# Altium project PCB_Project1.PrjPCB
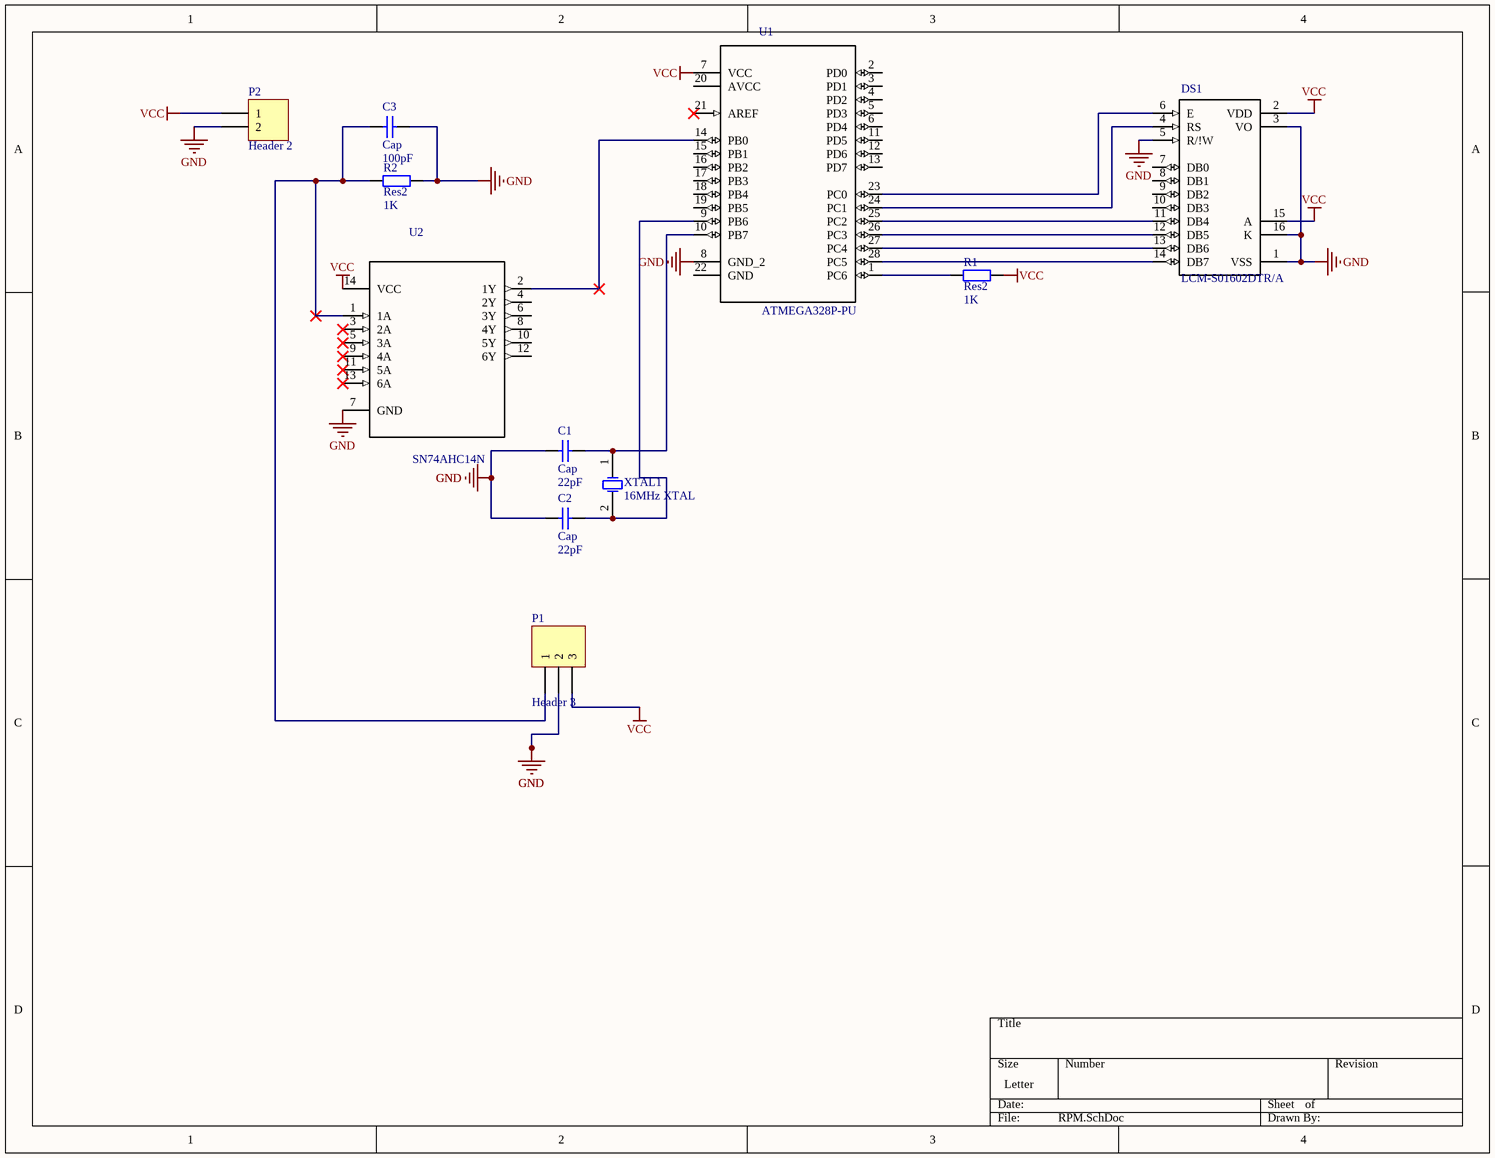
[diagram p0: RPM.SchDoc]
1 sheet, 11 parts. Net scope: global (net labels, ports and power ports of the same name join across sheets).
Board file: PCB1.PcbDoc

## Sheet RPM.SchDoc
size Letter

### Parts
C1  Cap  value 22pF  [RAD-0.3]
C2  Cap  value 22pF  [RAD-0.3]
C3  Cap  value 100pF  [RAD-0.3]
DS1  LCM-S01602DTR/A  [LCD_LCM-S01602DTR/A]
P1  Header 3  [HDR1X3]
P2  Header 2  [HDR1X2]
R1  Res2  value 1K  [AXIAL-0.4]
R2  Res2  value 1K  [AXIAL-0.4]
U1  ATMEGA328P-PU  [DIP254P762X457-28]  (net tie, no BOM)
U2  SN74AHC14N  [DIP254P762X508-14]
XTAL1  16MHz XTAL  [R38]

### Nets
GND: C1.1 C2.1 C3.2 DS1.1(VSS) DS1.3(VO) DS1.5(R/!W) DS1.16(K) P1.2 P2.2 R2.2 U1.8(GND_2) U2.7(GND)
VCC: DS1.2(VDD) DS1.15(A) P1.3 P2.1 R1.2 U1.7(VCC) U2.14(VCC)
NetC1_2: C1.2 U1.10(PB7) XTAL1.1(OSC1)
NetC2_2: C2.2 U1.9(PB6) XTAL1.2(OSC2)
NetC3_1: C3.1 P1.1 R2.1 U2.1(1A)
NetDS1_4: DS1.4(RS) U1.24(PC1)
NetDS1_6: DS1.6(E) U1.23(PC0)
NetDS1_11: DS1.11(DB4) U1.25(PC2)
NetDS1_12: DS1.12(DB5) U1.26(PC3)
NetDS1_13: DS1.13(DB6) U1.27(PC4)
NetDS1_14: DS1.14(DB7) U1.28(PC5)
NetR1_1: R1.1 U1.1(PC6)
NetU1_14: U1.14(PB0) U2.2(1Y)

Not connected (* = marked no-connect by the designer): DS1 7(DB0) 8(DB1) 9(DB2) 10(DB3); U1 2(PD0) 3(PD1) 4(PD2) 5(PD3) 6(PD4) 11(PD5) 12(PD6) 13(PD7) 15(PB1) 16(PB2) 17(PB3) 18(PB4) 19(PB5) 20(AVCC) 21(AREF)* 22(GND); U2 3(2A)* 4(2Y) 5(3A)* 6(3Y) 8(4Y) 9(4A)* 10(5Y) 11(5A)* 12(6Y) 13(6A)*

### Library data of the parts
C1-C3 = Cap: Capacitor; Published: 8-Jun-2000; LatestRevisionDate: 17-Jul-2002; LatestRevisionNote: Re-released for DXP Platform.; PackageReference: RAD-0.3; Publisher: Altium Limited; PackageDescription: Radial Cap, Thru-Hole; 2 Leads; 0.3 in Pin Spacing
DS1 = LCM-S01602DTR/A: Module, LCD; 16 x 2 mm; 5 x 8; 5 V _Typ._; 2 mA _Typ._; 4.2 V @50 degC _Min._; MF: Lumex; SnapEDA_Link: https://www.snapeda.com/parts/LCM-S01602DTR/A/Lumex%2520Opto/Components%2520Inc/view-part/?ref=snap; Availability: Warning; MP: LCM-S01602DTR/A; Price: 8.26 USD; Package: None; Value: *
P1 = Header 3: Header, 3-Pin; LatestRevisionDate: 17-Jul-2002; LatestRevisionNote: Re-released for DXP Platform.; Publisher: Altium Limited
P2 = Header 2: Header, 2-Pin; LatestRevisionDate: 17-Jul-2002; LatestRevisionNote: Re-released for DXP Platform.; Publisher: Altium Limited
R1 R2 = Res2: Resistor; Published: 8-Jun-2000; LatestRevisionDate: 17-Jul-2002; LatestRevisionNote: Re-released for DXP Platform.; PackageReference: AXIAL-0.4; Publisher: Altium Limited; PackageDescription: Axial Device, Thru-Hole; 2 Leads; 0.4 in Pin Spacing
U1 = ATMEGA328P-PU: Embedded microcontroller ATMEGA328P-PU PDIP 28 Microchip Technology 8-Bit 20 MHz I/O number 23; MF: Microchip; Digi-Key_Part_Number: ATMEGA328P-PU-ND; SnapEDA_Link: https://www.snapeda.com/parts/ATMEGA328P-PU/Microchip/view-part/?ref=snap; Package: PDIP-28 Microchip; MP: ATMEGA328P-PU; Digi-Key_Purchase_URL: https://www.digikey.com.eg/product-detail/en/microchip-technology/ATMEGA328P-PU/ATMEGA328P-PU-ND/1914589?utm_source=snapeda&utm_medium=aggregator&utm_campaign=symbol; Value: *
U2 = SN74AHC14N: Inverter Schmitt Trigger 6-Element CMOS 14-Pin PDIP Tube; MF: Texas Instruments; MP: SN74AHC14N; Package: DIP-14 Texas Instruments; Price: None; Availability: Unavailable; SnapEDA_Link: https://www.snapeda.com/parts/SN74AHC14N/Texas%20Instruments/view-part/?ref=snap; Value: *
XTAL1 = XTAL: Crystal Oscillator; Published: 8-Jun-2000; LatestRevisionDate: 17-Jul-2002; LatestRevisionNote: Re-released for DXP Platform.; PackageReference: R38; Publisher: Altium Limited; PackageDescription: Crystal, Thru-Hole; 2 Leads; Body 3.1 x 8.2 mm (Dia.xH)